# Altium schematic sheet Buttons wLED.SchDoc: Mini Editor Keyboard
size A3; DrawnBy: Roman Sklyar; Organization: S-LAB; Address1: Russian Federation; Address2: Sergiev Posad; DocumentNumber: 7; Revision: v1.0; SheetNumber: 7; SheetTotal: 7
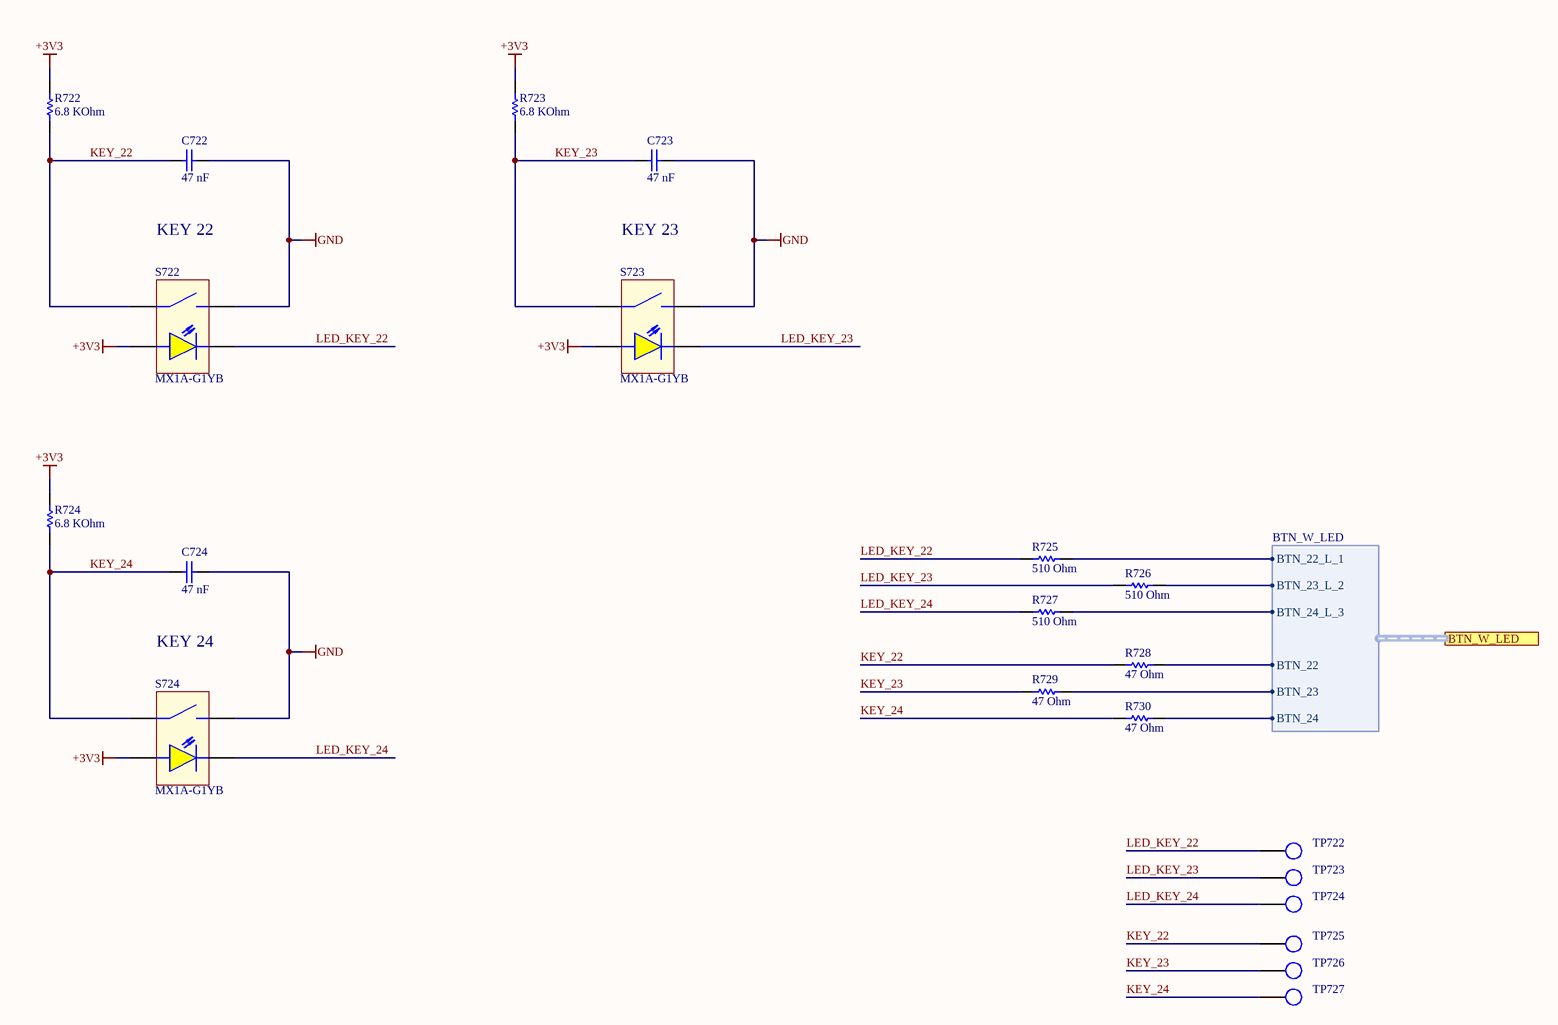
[diagram p0: Buttons wLED.SchDoc]

## Parts
C722  Capacitance: 47 nF  [CAPC0603]  (hidden comment: CAP-47N)
C723  Capacitance: 47 nF  [CAPC0603]  (hidden comment: CAP-47N)
C724  Capacitance: 47 nF  [CAPC0603]  (hidden comment: CAP-47N)
R722  Resistance: 6.8 KOhm  [RES0603]  (hidden comment: RES-6K8)
R723  Resistance: 6.8 KOhm  [RES0603]  (hidden comment: RES-6K8)
R724  Resistance: 6.8 KOhm  [RES0603]  (hidden comment: RES-6K8)
R725  Resistance: 510 Ohm  [RES0603]  (hidden comment: RES-510)
R726  Resistance: 510 Ohm  [RES0603]  (hidden comment: RES-510)
R727  Resistance: 510 Ohm  [RES0603]  (hidden comment: RES-510)
R728  Resistance: 47 Ohm  [RES0603]  (hidden comment: RES-47)
R729  Resistance: 47 Ohm  [RES0603]  (hidden comment: RES-47)
R730  Resistance: 47 Ohm  [RES0603]  (hidden comment: RES-47)
S722  KEY 22  [CHERRY MX PCB WITH LED]
S723  KEY 23  [CHERRY MX PCB WITH LED]
S724  KEY 24  [CHERRY MX PCB WITH LED]
TP722  (no value)  [TP_C-0.5mm]  (no BOM)
TP723  (no value)  [TP_C-0.5mm]  (no BOM)
TP724  (no value)  [TP_C-0.5mm]  (no BOM)
TP725  (no value)  [TP_C-0.5mm]  (no BOM)
TP726  (no value)  [TP_C-0.5mm]  (no BOM)
TP727  (no value)  [TP_C-0.5mm]  (no BOM)

## Ports
BTN_W_LED (harness BTN_W_LED)

## Harnesses
BTN_W_LED: BTN_23, BTN_24, BTN_22, BTN_22_L_1, BTN_23_L_2, BTN_24_L_3

## Nets
+3V3: R722.2 R723.2 R724.2 S722.A S723.A S724.A
GND: C722.2 C723.2 C724.2 S722.S2 S723.S2 S724.S2
KEY_22: C722.1 R722.1 R728.1 S722.S1 TP725.1
KEY_23: C723.1 R723.1 R729.1 S723.S1 TP726.1
KEY_24: C724.1 R724.1 R730.1 S724.S1 TP727.1
LED_KEY_22: R725.1 S722.K TP722.1
LED_KEY_23: R726.1 S723.K TP723.1
LED_KEY_24: R727.1 S724.K TP724.1
NetR725_2: R725.2 ; port BTN_W_LED.BTN_22_L_1
NetR726_2: R726.2 ; port BTN_W_LED.BTN_23_L_2
NetR727_2: R727.2 ; port BTN_W_LED.BTN_24_L_3
NetR728_2: R728.2 ; port BTN_W_LED.BTN_22
NetR729_2: R729.2 ; port BTN_W_LED.BTN_23
NetR730_2: R730.2 ; port BTN_W_LED.BTN_24

## Notes on the sheet
- Title
- Size:
- Date:
- A3
- Number:
- Time:
- Revision:
- Sheet
- of
- File:

## Library data of the parts
C722-C724 = CAP-47N: Chip Capacitor, 47 nF, +/- 5%; Voltage Rating: 50 V; Mount: Surface Mount; Tolerance: 5 %; Type: Capacitor
R722-R724 = RES-6K8: Chip Resistor, 6.8 KOhm, +/- 1%; Voltage Rating: 50 V; Mount: Surface Mount; Tolerance: 1 %; Type: Resistor
R725-R727 = RES-510: Chip Resistor, 510 Ohm, +/- 1%; Voltage Rating: 50 V; Mount: Surface Mount; Tolerance: 1 %; Type: Resistor
R728-R730 = RES-47: Chip Resistor, 47 Ohm, +/- 1%; Voltage Rating: 50 V; Mount: Surface Mount; Tolerance: 1 %; Type: Resistor
S722-S724 = MX1A-G1YB: CHERRY MX Brown RGB Keyswitch 55cN Yellow LED; Type: Switch; Mount: Through Hole; Model: MX1A-G1YB
TP722-TP727 = TestPad